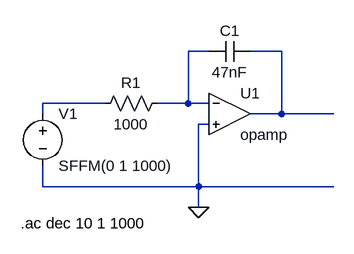
[diagram p0: schematic Op Amp.asc]
Op Amp.asc, the LTspice schematic file:
Version 4
SHEET 1 880 680
WIRE 160 64 128 64
WIRE 272 64 224 64
WIRE 0 144 -96 144
WIRE 128 144 128 64
WIRE 128 144 80 144
WIRE 160 144 128 144
WIRE -96 160 -96 144
WIRE 272 160 272 64
WIRE 272 160 224 160
WIRE 352 160 272 160
WIRE 160 176 144 176
WIRE -96 272 -96 240
WIRE 144 272 144 176
WIRE 144 272 -96 272
WIRE 352 272 144 272
WIRE 144 304 144 272
FLAG 144 304 0
SYMBOL cap 224 48 R90
WINDOW 0 0 32 VBottom 2
WINDOW 3 32 32 VTop 2
SYMATTR InstName C1
SYMATTR Value 47nF
SYMBOL res 96 128 R90
WINDOW 0 0 56 VBottom 2
WINDOW 3 32 56 VTop 2
SYMATTR InstName R1
SYMATTR Value 1000
SYMBOL voltage -96 144 R0
WINDOW 123 0 0 Left 0
WINDOW 39 0 0 Left 0
SYMATTR InstName V1
SYMATTR Value SFFM(0 1 1000)
SYMBOL OpAmps\\opamp 192 96 R0
SYMATTR InstName U1
TEXT -130 328 Left 2 !.ac dec 10 1 1000

The netlist it stands for:
* Op Amp.asc
C1 N002 N001 47nF
R1 N001 N003 1000
V1 N003 0 SFFM(0 1 1000)
XU1 N001 0 N002 opamp Aol=100K GBW=10Meg  ; pins invin noninvin out
.ac dec 10 1 1000
.backanno
.end